# Altium project WaveyRadar.PrjPcb (part 1 of 2)
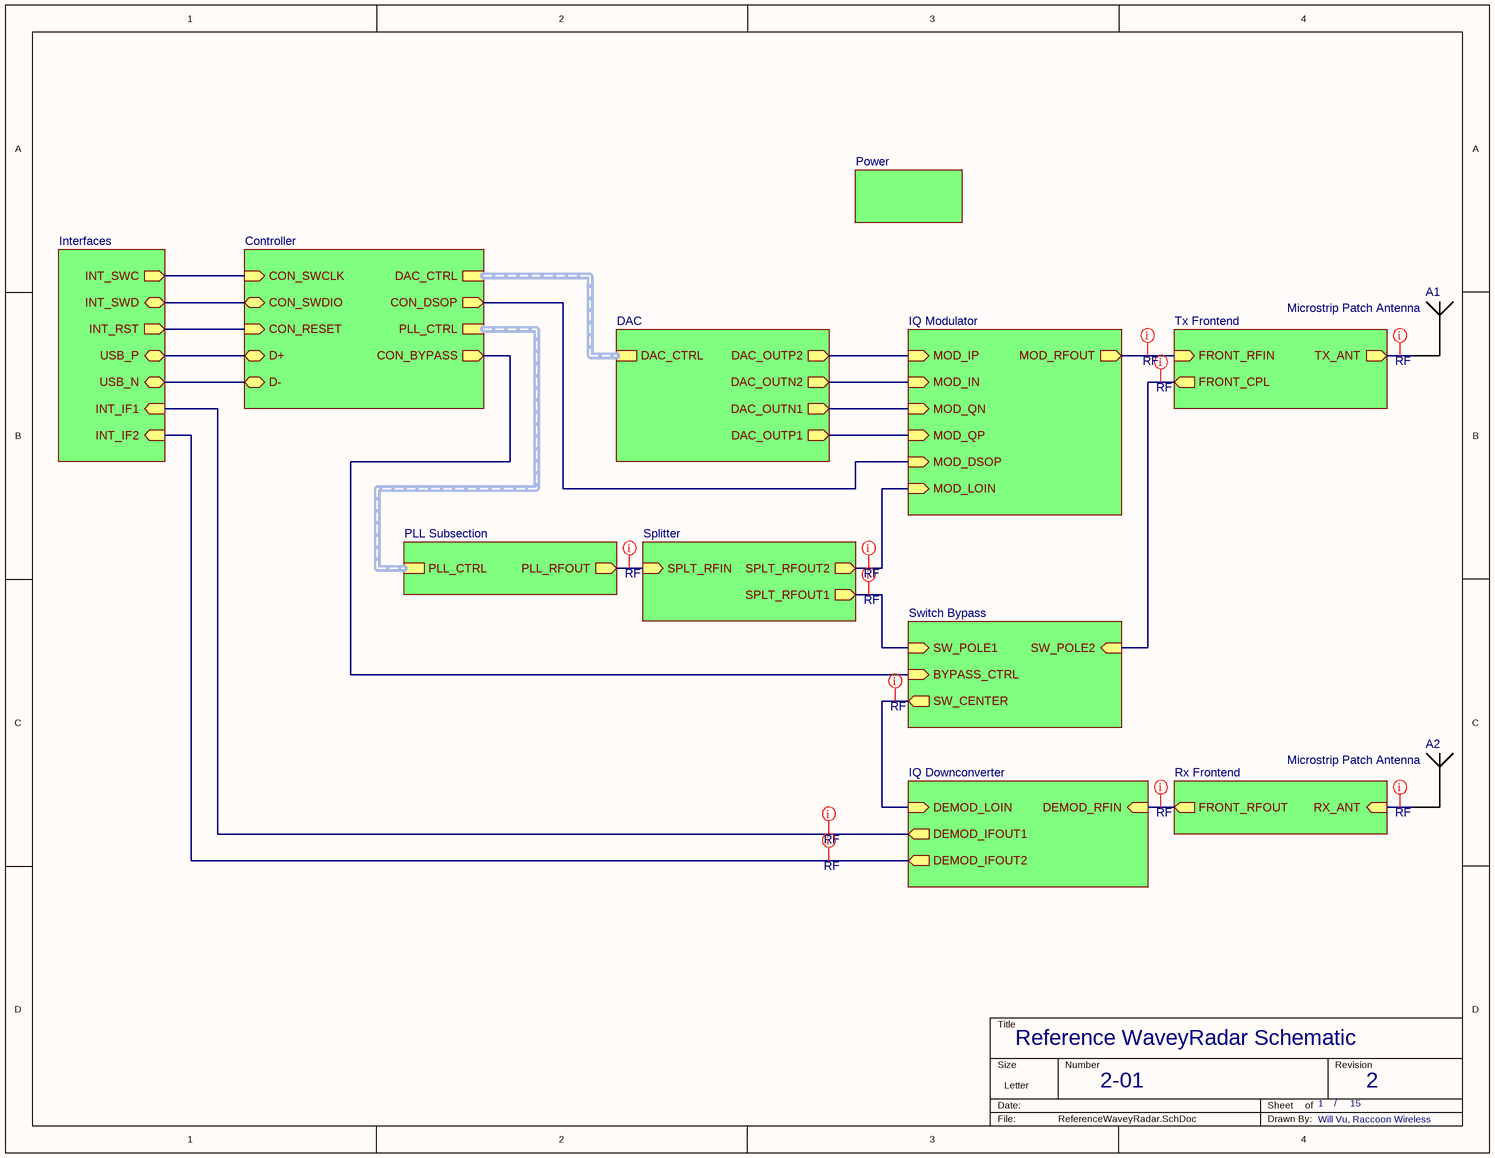
[diagram p0: ReferenceWaveyRadar.SchDoc]
Project Name: WaveyRadar
15 sheets, 143 parts. Net scope: hierarchical (ports join the sheet entries above them; power ports are global).
Board file: PCBWaveyRadar.PcbDoc
Sheets:
  ReferenceWaveyRadar.SchDoc
    Controller = ControllerWaveyRadar.SchDoc
    DAC = DACWaveyRadar.SchDoc
    IQ Downconverter = IQDownconverterWaveyRadar.SchDoc
    IQ Modulator = IQModulatorWaveyRadar.SchDoc
    PLL Subsection = PLLSubsectionWaveyRadar.SchDoc
      Ramp PLL = RampPLLWaveyRadar.SchDoc
      Loop Filter = LoopFilterWaveyRadar.SchDoc
      VCO = VCOWaveyRadar.SchDoc
    Power = PowerWaveyRadar.SchDoc
    Splitter = SplitterWaveyRadar.SchDoc
    Switch Bypass = SwitchBypassWaveyRadar.SchDoc
    Tx Frontend = TxFrontendWaveyRadar.SchDoc
    Rx Frontend = RxFrontendWaveyRadar.SchDoc
    Interfaces = InterfacesWaveyRadar.SchDoc

## Sheet ReferenceWaveyRadar.SchDoc: Reference WaveyRadar Schematic
size Letter; Author: Will Vu; CompanyName: Raccoon Wireless; DrawnBy: Will Vu, Raccoon Wireless; Engineer: Will Vu; Organization: Raccoon Wireless; DocumentNumber: 2-01; Revision: 2; SheetNumber: 1; SheetTotal: 15

### Parts
A1  Microstrip Patch Antenna  [Microstrip Patch Antenna]
A2  Microstrip Patch Antenna  [Microstrip Patch Antenna]

### Sub-sheets
Controller = ControllerWaveyRadar.SchDoc: D+ (bidir), D- (bidir), CON_SWDIO (bidir), CON_SWCLK (in), PLL_CTRL (harness PLL Control), DAC_CTRL (harness DAC Control), CON_BYPASS (out), CON_DSOP (out), CON_RESET (in)
DAC = DACWaveyRadar.SchDoc: DAC_OUTP2 (out), DAC_OUTN2 (out), DAC_OUTN1 (out), DAC_OUTP1 (out), DAC_CTRL (harness DAC Control)
Interfaces = InterfacesWaveyRadar.SchDoc: USB_N (bidir), USB_P (bidir), INT_SWD (bidir), INT_SWC (out), INT_RST (out), INT_IF1 (in), INT_IF2 (in)
IQ Downconverter = IQDownconverterWaveyRadar.SchDoc: DEMOD_RFIN (in), DEMOD_IFOUT1 (out), DEMOD_IFOUT2 (out), DEMOD_LOIN (in)
IQ Modulator = IQModulatorWaveyRadar.SchDoc: MOD_LOIN (in), MOD_RFOUT (out), MOD_IP (in), MOD_IN (in), MOD_QN (in), MOD_QP (in), MOD_DSOP (in)
PLL Subsection = PLLSubsectionWaveyRadar.SchDoc: PLL_CTRL (harness PLL Control), PLL_RFOUT (out)
Power = PowerWaveyRadar.SchDoc: no entries
Rx Frontend = RxFrontendWaveyRadar.SchDoc: FRONT_RFOUT (out), RX_ANT (in)
Splitter = SplitterWaveyRadar.SchDoc: SPLT_RFIN (in), SPLT_RFOUT2 (out), SPLT_RFOUT1 (out)
Switch Bypass = SwitchBypassWaveyRadar.SchDoc: SW_POLE1 (in), SW_CENTER (out), SW_POLE2 (in), BYPASS_CTRL (in)
Tx Frontend = TxFrontendWaveyRadar.SchDoc: FRONT_RFIN (in), FRONT_CPL (out), TX_ANT (out)

### Nets
D_N: sheet Controller/D-, sheet Interfaces/USB_N
D_P: sheet Controller/D+, sheet Interfaces/USB_P
DAC_OUT1_N: sheet DAC/DAC_OUTN1, sheet IQ Modulator/MOD_QN
DAC_OUT1_P: sheet DAC/DAC_OUTP1, sheet IQ Modulator/MOD_QP
DAC_OUT2_N: sheet DAC/DAC_OUTN2, sheet IQ Modulator/MOD_IN
DAC_OUT2_P: sheet DAC/DAC_OUTP2, sheet IQ Modulator/MOD_IP
NetA1_1: A1.1(RFIN) ; sheet Tx Frontend/TX_ANT
NetA2_1: A2.1(RFIN) ; sheet Rx Frontend/RX_ANT
NetC26_1: sheet Controller/CON_BYPASS, sheet Switch Bypass/BYPASS_CTRL
NetC28_1: sheet IQ Modulator/MOD_LOIN, sheet Splitter/SPLT_RFOUT2
NetC31_2: sheet IQ Modulator/MOD_RFOUT, sheet Tx Frontend/FRONT_RFIN
NetDC1_6: sheet Switch Bypass/SW_POLE2, sheet Tx Frontend/FRONT_CPL
NetIC1_3: sheet IQ Downconverter/DEMOD_LOIN, sheet Switch Bypass/SW_CENTER
NetIC1_9: sheet Splitter/SPLT_RFOUT1, sheet Switch Bypass/SW_POLE1
NetJ5_1: sheet IQ Downconverter/DEMOD_IFOUT1, sheet Interfaces/INT_IF1
NetJ6_1: sheet IQ Downconverter/DEMOD_IFOUT2, sheet Interfaces/INT_IF2
NetJ7_1: sheet Controller/CON_SWDIO, sheet Interfaces/INT_SWD
NetJ7_2: sheet Controller/CON_SWCLK, sheet Interfaces/INT_SWC
NetJ7_3: sheet Controller/CON_RESET, sheet Interfaces/INT_RST
NetR12_1: sheet PLL Subsection/PLL_RFOUT, sheet Splitter/SPLT_RFIN
NetU5_1: sheet Controller/CON_DSOP, sheet IQ Modulator/MOD_DSOP
NetU7_5: sheet IQ Downconverter/DEMOD_RFIN, sheet Rx Frontend/FRONT_RFOUT

### Buses and harness runs
harness sheet Controller/DAC_CTRL = sheet DAC/DAC_CTRL
harness sheet Controller/PLL_CTRL = sheet PLL Subsection/PLL_CTRL

### Layout directives
net class RF: NetA1_1, NetA2_1, NetC28_1, NetC31_2, NetDC1_6, NetIC1_3, NetIC1_9, NetJ5_1, NetJ6_1, NetR12_1, NetU7_5

### Notes on the sheet
- /

### Library data of the parts
A1 A2 = CMP-00025-00007-16: PCB Patch Antenna

## Sheet ControllerWaveyRadar.SchDoc: Controller WaveyRadar Schematic
size Letter; Author: Will Vu; CompanyName: Raccoon Wireless; DrawnBy: Will Vu, Raccoon Wireless; Engineer: Will Vu; Organization: Raccoon Wireless; DocumentNumber: 2-15; Revision: 2; SheetNumber: 15; SheetTotal: 15
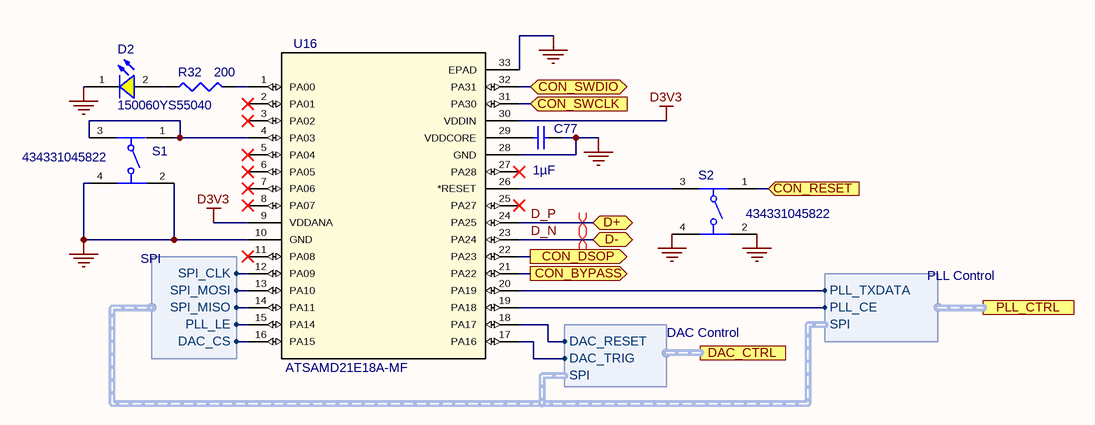
[diagram p1: ControllerWaveyRadar.SchDoc]

### Parts
C77  value 1µF  [CAPC0402(1005)60_L]  (hidden comment: Capacitor 1µF +/-20% 10V 0402)
D2  150060YS55040  [WL-SMCD_0603]
R32  value 200  [RESC0402(1005)_L]  (hidden comment: Resistor 200R +/-5 % 0402 63 mW)
S1  434331045822  [434331045822]
S2  434331045822  [434331045822]
U16  ATSAMD21E18A-MF  [QFN32_5X5MC_MCH]

### Ports
CON_BYPASS (out), CON_DSOP (out), CON_RESET (in), CON_SWCLK (in), CON_SWDIO (bidir), D+ (bidir), D- (bidir), DAC_CTRL (harness DAC Control), PLL_CTRL (harness PLL Control)

### Harnesses
PLL Control: PLL_CE, PLL_TXDATA, SPI
DAC Control: SPI, DAC_RESET, DAC_TRIG
SPI: SPI_MOSI, SPI_CLK, PLL_LE, SPI_MISO, DAC_CS

### Nets
D3V3: U16.9(VDDANA) U16.30(VDDIN)
GND: C77.2 D2.1(K) S1.2 S1.4 S2.2 S2.4 U16.10(GND) U16.28(GND) U16.33(EPAD)
D_N: U16.23(PA24) ; port D-
D_P: U16.24(PA25) ; port D+
NetC26_1: U16.21(PA22) ; port CON_BYPASS
NetC77_1: C77.1 U16.29(VDDCORE)
NetD2_2: D2.2(A) R32.1
NetJ7_1: U16.32(PA31) ; port CON_SWDIO
NetJ7_2: U16.31(PA30) ; port CON_SWCLK
NetJ7_3: S2.1 ; port CON_RESET
NetR32_2: R32.2 U16.1(PA00)
NetS1_1: S1.1 S1.3 U16.4(PA03)
NetS2_3: S2.3 U16.26(*RESET)
NetU2_11: U16.14(PA11) ; harness SPI.SPI_MISO
NetU2_12: U16.15(PA14) ; harness SPI.PLL_LE
NetU2_13: U16.19(PA18) ; port PLL_CTRL.PLL_CE
NetU2_14: U16.20(PA19) ; port PLL_CTRL.PLL_TXDATA
NetU2_15: U16.13(PA10) ; harness SPI.SPI_MOSI
NetU2_16: U16.12(PA09) ; harness SPI.SPI_CLK
NetU5_1: U16.22(PA23) ; port CON_DSOP
NetU6_8: U16.16(PA15) ; harness SPI.DAC_CS
NetU6_9: U16.18(PA17) ; port DAC_CTRL.DAC_RESET
NetU6_32: U16.17(PA16) ; port DAC_CTRL.DAC_TRIG

Not connected (* = marked no-connect by the designer): U16 2(PA01)* 3(PA02)* 5(PA04)* 6(PA05)* 7(PA06)* 8(PA07)* 11(PA08)* 25(PA27)* 27(PA28)*

### Layout directives
differential pair: D_N, D_P

### Notes on the sheet
- /

### Library data of the parts
C77 = CMP-001-00063-4: Chip Capacitor, 1µF +/-20%, 10V, 0402, Thickness 0.6 mm; Tolerance: 10%; Max Operating Temperature: 85°C; Mounting Technology: SMT; Pins: 2; Min Operating Temperature: -55°C; Voltage Rating: 10V; Case/Package: 0402
D2 = CMP-072-000005-2: WL-SMCD SMT Mono-color Chip LED Diffused, size 0603, Yellow, 2V, 140deg; Chip Technology: AlInGaP; Dominant Wavelength: 589nm; Luminous Intensity: 100mcd; Peak Wavelength: 591nm; ComponentLink1Description: Manufacturer; Publisher: Wurth Elektronik; Part Number: 150060YS55040; Design Item ID: 150060YS55040; Viewing Angle: 140deg; ComponentLink1URL: http://www.we-online.de; Emitting Color: Yellow; ComponentLink2URL: https://katalog.we-online.de/led/datasheet/150060YS55040.pdf; Packaging: Tape and Reel; ComponentLink2Description: Datasheet; Source: WL-SMCD.SchLib; Mounting Technology: SMT; Published Date: October 2019; Operating Temperature: -40 to +85degC; Forward Voltage: 2V; Size: 0603
R32 = CMP-009-00161-4: Chip Resistor, 200 Ohms, +/-5 %, 63 mW, -55 to 155 degC, 0402; Power: 63mW; Tolerance: 5%; Pins: 2; Max Operating Temperature: 155°C; Min Operating Temperature: -55°C; Case/Package: 0402
S1 S2 = CMP-083-000001-1: WS-TASU SMT Tact Switch 4.7x3.5mm side push, height 1.65mm, 220gf; Manufacturer: Wurth Elektronik; Rated Voltage: 12VDC; Washable: No; Rated Current: 50mA; Terminal Material: Copper Alloy; ComponentLink1URL: http://www.we-online.de; Operating Temperature: -40 to +85degC; Design Item ID: 434331045822; ComponentLink1Description: Manufacturer; Published Date: January 2021; Terminal Plating: Silver; Height: 1.65mm; Mounting Technology: SMT; ComponentLink2URL: https://www.we-online.com/catalog/datasheet/434331045822.pdf; ComponentLink2Description: Datasheet; Operation Force: 220gf; Contact Plating: Silver; Contact Material: Stainless Steel; Source: WS-TASU.SchLib; Packaging: Tape and Reel; Manufacturer Part Number: 434331045822
U16 = CMP-056-000000-3: No Description Available; Built_By: EMA_Molly; SourceLibrary: Microchip_2019-08-23_25; Vendor: Microchip; Type: DEV; Manufacturer_Part_Number: ATSAMD21E18A-MF; Design Item ID: ATSAMD21E18A-MF; RefDes: RefDes; Source: 2021-06-30_23-48-05.SchLib; Copyright: Copyright (C) 2018 Accelerated Designs. All rights reserved

## Sheet DACWaveyRadar.SchDoc: DAC WaveyRadar Schematic
size Letter; Author: Will Vu; CompanyName: Raccoon Wireless; DrawnBy: Will Vu, Raccoon Wireless; Engineer: Will Vu; Organization: Raccoon Wireless; DocumentNumber: 2-09; Revision: 2; SheetNumber: 9; SheetTotal: 15
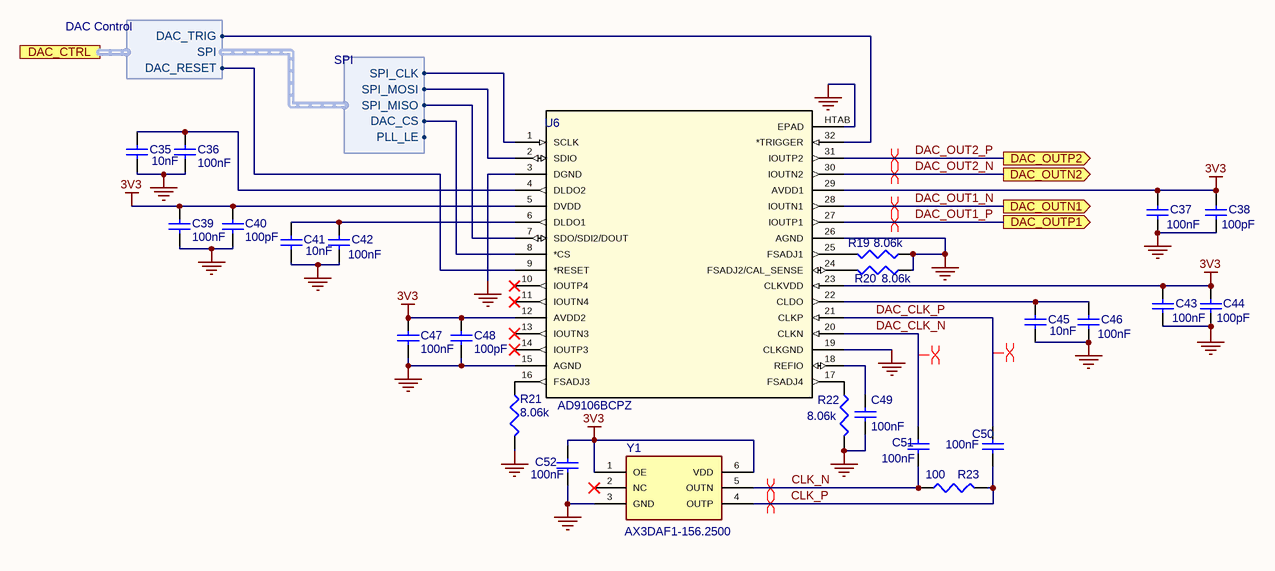
[diagram p2: DACWaveyRadar.SchDoc]

### Parts
C35  value 10nF  [CAPC0402(1005)60_L]  (hidden comment: Capacitor 10nF +/-20% 50V 0402)
C36  value 100nF  [CAPC0402(1005)60_L]  (hidden comment: Capacitor 100nF +/-20% 10V 0402)
C37  value 100nF  [CAPC0402(1005)60_L]  (hidden comment: Capacitor 100nF +/-20% 10V 0402)
C38  value 100pF  [CAPC1005X56X25LL10T15]  (hidden comment: 04023A101JAT2A)
C39  value 100nF  [CAPC0402(1005)60_L]  (hidden comment: Capacitor 100nF +/-20% 10V 0402)
C40  value 100pF  [CAPC1005X56X25LL10T15]  (hidden comment: 04023A101JAT2A)
C41  value 10nF  [CAPC0402(1005)60_L]  (hidden comment: Capacitor 10nF +/-20% 50V 0402)
C42  value 100nF  [CAPC0402(1005)60_L]  (hidden comment: Capacitor 100nF +/-20% 10V 0402)
C43  value 100nF  [CAPC0402(1005)60_L]  (hidden comment: Capacitor 100nF +/-20% 10V 0402)
C44  value 100pF  [CAPC1005X56X25LL10T15]  (hidden comment: 04023A101JAT2A)
C45  value 10nF  [CAPC0402(1005)60_L]  (hidden comment: Capacitor 10nF +/-20% 50V 0402)
C46  value 100nF  [CAPC0402(1005)60_L]  (hidden comment: Capacitor 100nF +/-20% 10V 0402)
C47  value 100nF  [CAPC0402(1005)60_L]  (hidden comment: Capacitor 100nF +/-20% 10V 0402)
C48  value 100pF  [CAPC1005X56X25LL10T15]  (hidden comment: 04023A101JAT2A)
C49  value 100nF  [CAPC0402(1005)60_L]  (hidden comment: Capacitor 100nF +/-20% 10V 0402)
C50  value 100nF  [CAPC0402(1005)60_L]  (hidden comment: Capacitor 100nF +/-20% 10V 0402)
C51  value 100nF  [CAPC0402(1005)60_L]  (hidden comment: Capacitor 100nF +/-20% 10V 0402)
C52  value 100nF  [CAPC0402(1005)60_L]  (hidden comment: Capacitor 100nF +/-20% 10V 0402)
R19  value 8.06k  [RESC1005X40X25ML05T05]  (hidden comment: CRCW04028K06FKED)
R20  value 8.06k  [RESC1005X40X25ML05T05]  (hidden comment: CRCW04028K06FKED)
R21  value 8.06k  [RESC1005X40X25ML05T05]  (hidden comment: CRCW04028K06FKED)
R22  value 8.06k  [RESC1005X40X25ML05T05]  (hidden comment: CRCW04028K06FKED)
R23  value 100  [RESC0402(1005)_L]  (hidden comment: Resistor 100R +/-1 % 0402 63 mW)
U6  AD9106BCPZ  [CP_32_12_ADI]
Y1  AX3DAF1-156.2500  [AX3DAF1]

### Ports
DAC_CTRL (harness DAC Control), DAC_OUTN1 (out), DAC_OUTN2 (out), DAC_OUTP1 (out), DAC_OUTP2 (out)

### Harnesses
SPI: SPI_MOSI, SPI_CLK, PLL_LE, SPI_MISO, DAC_CS
DAC Control: SPI, DAC_RESET, DAC_TRIG

### Nets
3V3: C37.2 C38.2 C39.1 C40.1 C43.2 C44.2 C47.1 C48.1 C52.1 U6.5(DVDD) U6.12(AVDD2) U6.23(CLKVDD) U6.29(AVDD1) Y1.1(OE) Y1.6(VDD)
GND: C35.2 C36.1 C37.1 C38.1 C39.2 C40.2 C41.2 C42.1 C43.1 C44.1 C45.2 C46.1 C47.2 C48.2 C49.2 C52.2 R19.1 R20.1 R21.2 R22.2 U6.3(DGND) U6.15(AGND) U6.19(CLKGND) U6.26(AGND) U6.HTAB(EPAD) Y1.3(GND)
CLK_N: C51.2 R23.1 Y1.5(OUTN)
CLK_P: C50.2 R23.2 Y1.4(OUTP)
DAC_CLK_N: C51.1 U6.20(CLKN)
DAC_CLK_P: C50.1 U6.21(CLKP)
DAC_OUT1_N: U6.28(IOUTN1) ; port DAC_OUTN1
DAC_OUT1_P: U6.27(IOUTP1) ; port DAC_OUTP1
DAC_OUT2_N: U6.30(IOUTN2) ; port DAC_OUTN2
DAC_OUT2_P: U6.31(IOUTP2) ; port DAC_OUTP2
NetC35_1: C35.1 C36.2 U6.4(DLDO2)
NetC41_1: C41.1 C42.2 U6.6(DLDO1)
NetC45_1: C45.1 C46.2 U6.22(CLDO)
NetC49_1: C49.1 U6.18(REFIO)
NetR19_2: R19.2 U6.25(FSADJ1)
NetR20_2: R20.2 U6.24(FSADJ2/CAL_SENSE)
NetR21_1: R21.1 U6.16(FSADJ3)
NetR22_1: R22.1 U6.17(FSADJ4)
NetU2_11: U6.7(SDO/SDI2/DOUT) ; harness SPI.SPI_MISO
NetU2_15: U6.2(SDIO) ; harness SPI.SPI_MOSI
NetU2_16: U6.1(SCLK) ; harness SPI.SPI_CLK
NetU6_8: U6.8(*CS) ; harness SPI.DAC_CS
NetU6_9: U6.9(*RESET) ; port DAC_CTRL.DAC_RESET
NetU6_32: U6.32(*TRIGGER) ; port DAC_CTRL.DAC_TRIG

Not connected (* = marked no-connect by the designer): U6 10(IOUTP4)* 11(IOUTN4)* 13(IOUTN3)* 14(IOUTP3)*; Y1 2(NC)*

### Layout directives
differential pair: CLK_N, CLK_P, DAC_CLK_N, DAC_CLK_P, DAC_OUT1_N, DAC_OUT1_P, DAC_OUT2_N, DAC_OUT2_P

### Notes on the sheet
- /

### Library data of the parts
C35 C41 C45 = CMP-001-00069-4: Chip Capacitor, 10nF +/-20%, 50V, 0402, Thickness 0.6 mm; Tolerance: 5%; Max Operating Temperature: 85°C; Voltage Rating: 50V; Case/Package: 0402; Pins: 2; Min Operating Temperature: -55°C; Mounting Technology: SMT
C36 C37 C39 C42 C43 C46 C47 C49-C52 = CMP-001-00061-4: Chip Capacitor, 100nF +/-20%, 10V, 0402, Thickness 0.6 mm; Tolerance: 20%; Case/Package: 0402; Voltage Rating: 10V; Pins: 2; Mounting Technology: SMT; Max Operating Temperature: 85°C; Min Operating Temperature: -55°C
C38 C40 C44 C48 = CMP-001-00083-2: AVX - 04023A101JAT2A - SMD Multilayer Ceramic Capacitor, 100 pF, 25 V, 0402 [1005 Metric], ± 5%, C0G / NP0, AVX 0402 MLCC
R19-R22 = CMP-009-00189-1: Res Thick Film 0402 8.06K Ohm 1% 0.063W(1/16W) ±100ppm/C Molded SMD Automotive Paper T/R
R23 = CMP-009-00167-4: Chip Resistor, 100 Ohms, +/-1 %, 63 mW, -55 to 155 degC, 0402; Power: 63mW; Tolerance: 1%; Pins: 2; Min Operating Temperature: -55°C; Case/Package: 0402; Max Operating Temperature: 155°C
U6 = CMP-014-000000-5: No Description Available; Vendor: Analog Devices Inc; SourceLibrary: Analog_2015-01-06; Built_By: EMA_UL_Team; Design Item ID: AD9106BCPZ; Type: DEV; Copyright: Copyright (C) 2018 Accelerated Designs. All rights reserved; RefDes: RefDes; Source: 2021-05-30_21-42-50.SchLib; Manufacturer_Part_Number: AD9106BCPZ
Y1 = CMP-017-000000-3: Oscillator XO 156.25MHz ±50ppm LVDS 55% 3.3V 6-Pin SMD Bulk; Manufacturer_Name: ABRACON; Height: 1.1mm; Datasheet Link: https://abracon.com/datasheets/AX3.pdf; Source: SamacSys.SchLib; Manufacturer_Part_Number: AX3DAF1-156.2500; Value: 156.25MHz; Design Item ID: AX3DAF1-156.2500

## Sheet IQDownconverterWaveyRadar.SchDoc: IQ Downconverter WaveyRadar Schematic
size Letter; Author: Will Vu; CompanyName: Raccoon Wireless; DrawnBy: Will Vu, Raccoon Wireless; Engineer: Will Vu; Organization: Raccoon Wireless; DocumentNumber: 2-10; Revision: 2; SheetNumber: 10; SheetTotal: 15
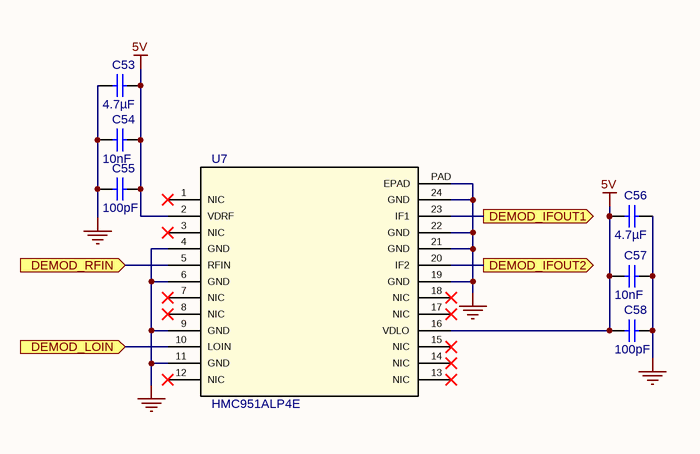
[diagram p3: IQDownconverterWaveyRadar.SchDoc]

### Parts
C53  value 4.7µF  [CAPC0603(1608)100_L]  (hidden comment: Capacitor 4.7µF +/-20% 10V 0603)
C54  value 10nF  [CAPC0402(1005)60_L]  (hidden comment: Capacitor 10nF +/-20% 50V 0402)
C55  value 100pF  [CAPC1005X56X25LL10T15]  (hidden comment: 04023A101JAT2A)
C56  value 4.7µF  [CAPC0603(1608)100_L]  (hidden comment: Capacitor 4.7µF +/-20% 10V 0603)
C57  value 10nF  [CAPC0402(1005)60_L]  (hidden comment: Capacitor 10nF +/-20% 50V 0402)
C58  value 100pF  [CAPC1005X56X25LL10T15]  (hidden comment: 04023A101JAT2A)
U7  HMC951ALP4E  [HCP_24_3]

### Ports
DEMOD_IFOUT1 (out), DEMOD_IFOUT2 (out), DEMOD_LOIN (in), DEMOD_RFIN (in)

### Nets
5V: C53.2 C54.2 C55.2 C56.1 C57.1 C58.1 U7.2(VDRF) U7.16(VDLO)
GND: C53.1 C54.1 C55.1 C56.2 C57.2 C58.2 U7.4(GND) U7.6(GND) U7.9(GND) U7.11(GND) U7.19(GND) U7.21(GND) U7.22(GND) U7.24(GND) U7.PAD(EPAD)
NetIC1_3: U7.10(LOIN) ; port DEMOD_LOIN
NetJ5_1: U7.23(IF1) ; port DEMOD_IFOUT1
NetJ6_1: U7.20(IF2) ; port DEMOD_IFOUT2
NetU7_5: U7.5(RFIN) ; port DEMOD_RFIN

Not connected (* = marked no-connect by the designer): U7 1(NIC)* 3(NIC)* 7(NIC)* 8(NIC)* 12(NIC)* 13(NIC)* 14(NIC)* 15(NIC)* 17(NIC)* 18(NIC)*

### Notes on the sheet
- /

### Library data of the parts
C53 C56 = CMP-001-00076-5: Chip Capacitor, 4.7µF +/-20%, 10V, 0603, Thickness 1 mm; Tolerance: 10%; Mounting Technology: SMT; Pins: 2; Max Operating Temperature: 85°C; Case/Package: 0603; Voltage Rating: 10V; Min Operating Temperature: -55°C
C54 C57 = CMP-001-00069-4: as C35 on sheet DACWaveyRadar; Max Operating Temperature: 85°C; Voltage Rating: 50V; Case/Package: 0402; Pins: 2; Min Operating Temperature: -55°C; Mounting Technology: SMT
C55 C58 = CMP-001-00083-2: as C38 on sheet DACWaveyRadar
U7 = CMP-021-000000-5: 5.6  GHz to 8.6 GHz, GaAs, MMIC, I/Q Downconverter; RefDes: RefDes; Copyright: Copyright (C) 2018 Accelerated Designs. All rights reserved; Type: DEV; Design Item ID: HMC951ALP4E; Source: 2021-05-31_20-45-29.SchLib

## Sheet IQModulatorWaveyRadar.SchDoc: IQ Modulator WaveyRadar Schematic
size Letter; Author: Will Vu; CompanyName: Raccoon Wireless; DrawnBy: Will Vu, Raccoon Wireless; Engineer: Will Vu; Organization: Raccoon Wireless; DocumentNumber: 2-08; Revision: 2; SheetNumber: 8; SheetTotal: 15
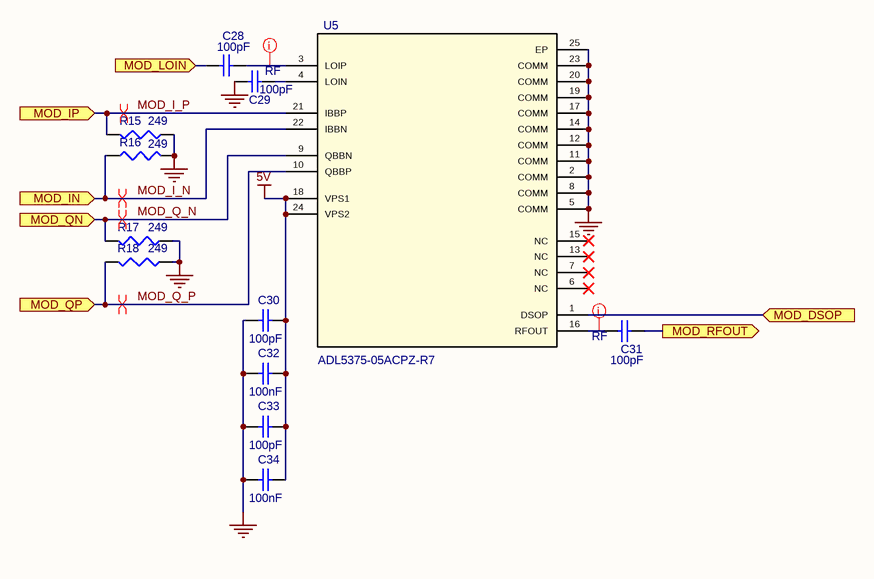
[diagram p4: IQModulatorWaveyRadar.SchDoc]

### Parts
C28  value 100pF  [CAPC1005X56X25LL10T15]  (hidden comment: 04023A101JAT2A)
C29  value 100pF  [CAPC1005X56X25LL10T15]  (hidden comment: 04023A101JAT2A)
C30  value 100pF  [CAPC1005X56X25LL10T15]  (hidden comment: 04023A101JAT2A)
C31  value 100pF  [CAPC1005X56X25LL10T15]  (hidden comment: 04023A101JAT2A)
C32  value 100nF  [CAPC0402(1005)60_L]  (hidden comment: Capacitor 100nF +/-20% 10V 0402)
C33  value 100pF  [CAPC1005X56X25LL10T15]  (hidden comment: 04023A101JAT2A)
C34  value 100nF  [CAPC0402(1005)60_L]  (hidden comment: Capacitor 100nF +/-20% 10V 0402)
R15  value 249  [RESC1005X40X25NL05T05]  (hidden comment: ERJ-2RKF2490X)
R16  value 249  [RESC1005X40X25NL05T05]  (hidden comment: ERJ-2RKF2490X)
R17  value 249  [RESC1005X40X25NL05T05]  (hidden comment: ERJ-2RKF2490X)
R18  value 249  [RESC1005X40X25NL05T05]  (hidden comment: ERJ-2RKF2490X)
U5  ADL5375-05ACPZ-R7  [CP_24_7_ADI]

### Ports
MOD_DSOP (in), MOD_IN (in), MOD_IP (in), MOD_LOIN (in), MOD_QN (in), MOD_QP (in), MOD_RFOUT (out)

### Nets
5V: C30.2 C32.2 C33.2 C34.2 U5.18(VPS1) U5.24(VPS2)
GND: C29.1 C30.1 C32.1 C33.1 C34.1 R15.1 R16.2 R17.1 R18.1 U5.2(COMM) U5.5(COMM) U5.8(COMM) U5.11(COMM) U5.12(COMM) U5.14(COMM) U5.17(COMM) U5.19(COMM) U5.20(COMM) U5.23(COMM) U5.25(EP)
MOD_I_N: R16.1 U5.22(IBBN) ; port MOD_IN  [project net DAC_OUT2_N]
MOD_I_P: R15.2 U5.21(IBBP) ; port MOD_IP  [project net DAC_OUT2_P]
MOD_Q_N: R17.2 U5.9(QBBN) ; port MOD_QN  [project net DAC_OUT1_N]
MOD_Q_P: R18.2 U5.10(QBBP) ; port MOD_QP  [project net DAC_OUT1_P]
NetC28_1: C28.1 ; port MOD_LOIN
NetC28_2: C28.2 U5.3(LOIP)
NetC29_2: C29.2 U5.4(LOIN)
NetC31_1: C31.1 U5.16(RFOUT)
NetC31_2: C31.2 ; port MOD_RFOUT
NetU5_1: U5.1(DSOP) ; port MOD_DSOP

Not connected (* = marked no-connect by the designer): U5 6(NC)* 7(NC)* 13(NC)* 15(NC)*

### Layout directives
differential pair: DAC_OUT1_N, DAC_OUT1_P, DAC_OUT2_N, DAC_OUT2_P
net class RF: NetC28_2, NetC31_1

### Notes on the sheet
- /

### Library data of the parts
C28-C31 C33 = CMP-001-00083-2: as C38 on sheet DACWaveyRadar
C32 C34 = CMP-001-00061-4: as C36 on sheet DACWaveyRadar; Case/Package: 0402; Voltage Rating: 10V; Pins: 2; Mounting Technology: SMT; Max Operating Temperature: 85°C; Min Operating Temperature: -55°C
R15-R18 = CMP-009-00185-1: RESISTOR, 0402, 249R 1%, 0.1W
U5 = CMP-007-000001-5: IC MOD QUAD 400MHZ-6GHZ 24LFCSP; P1dB: 10.4dBm; Built_By: EMA_UL_Team; Output Power (dBm): 1.71dBm; Operating Supply Voltage: 5.25V; Supply Current: 174mA; Max Power Dissipation: 1.5W; Operating Supply Current: 200mA; SourceLibrary: Analog_2015-12-15; Vendor: Analog Devices Inc; Test Frequency: 3.5GHz; Source: 2021-05-25_00-39-48.SchLib; Case/Package: LFCSP EP; Type: DEV; Min Operating Temperature: -40°C; RoHS Compliant: Yes; Copyright: Copyright (C) 2018 Accelerated Designs. All rights reserved; Packaging: Tape and Reel; RefDes: RefDes; Radiation Hardening: No; Max Operating Temperature: 85°C; Design Item ID: ADL5375-05ACPZ-R7; Package Quantity: 1; Number of Pins: 24; Lead Free: Contains Lead; Nominal Supply Current: 174mA; Series: -; Manufacturer_Part_Number: ADL5375-05ACPZ-R7

## Sheet PLLSubsectionWaveyRadar.SchDoc: PLL Subsection WaveyRadar Schematic
size Letter; Author: Will Vu; CompanyName: Raccoon Wireless; DrawnBy: Will Vu, Raccoon Wireless; Engineer: Will Vu; Organization: Raccoon Wireless; DocumentNumber: 2-02; Revision: 2; SheetNumber: 2; SheetTotal: 15
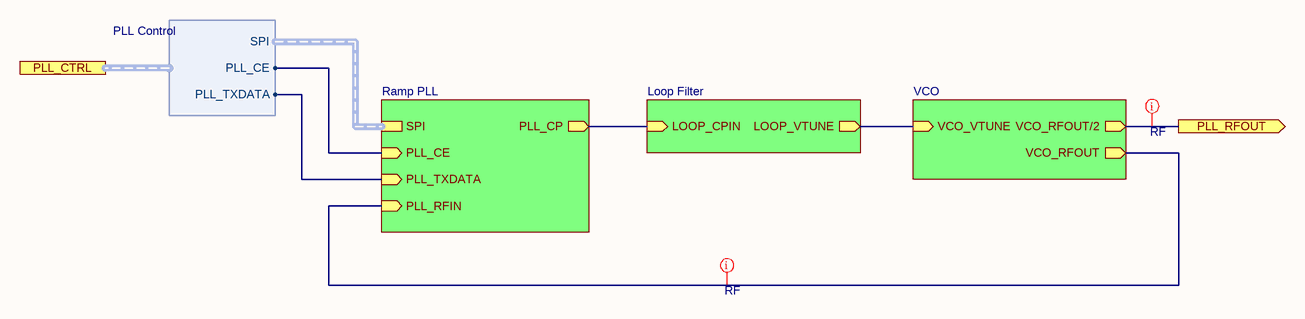
[diagram p5: PLLSubsectionWaveyRadar.SchDoc]

### Sub-sheets
Loop Filter = LoopFilterWaveyRadar.SchDoc: LOOP_VTUNE (out), LOOP_CPIN (in)
Ramp PLL = RampPLLWaveyRadar.SchDoc: SPI (harness SPI), PLL_RFIN (in), PLL_TXDATA (in), PLL_CE (in), PLL_CP (out)
VCO = VCOWaveyRadar.SchDoc: VCO_RFOUT/2 (out), VCO_RFOUT (out), VCO_VTUNE (in)

### Ports
PLL_CTRL (harness PLL Control), PLL_RFOUT (out)

### Harnesses
PLL Control: PLL_CE, PLL_TXDATA, SPI

### Nets
NetC15_2: sheet Ramp PLL/PLL_CP, sheet Loop Filter/LOOP_CPIN
NetC16_1: sheet Loop Filter/LOOP_VTUNE, sheet VCO/VCO_VTUNE
NetR1_1: sheet Ramp PLL/PLL_RFIN, sheet VCO/VCO_RFOUT
NetR12_1: port PLL_RFOUT, sheet VCO/VCO_RFOUT/2
NetU2_13: sheet Ramp PLL/PLL_CE, port PLL_CTRL.PLL_CE
NetU2_14: sheet Ramp PLL/PLL_TXDATA, port PLL_CTRL.PLL_TXDATA

### Layout directives
net class RF: NetR1_1, NetR12_1

### Notes on the sheet
- /

## Sheet RampPLLWaveyRadar.SchDoc: Ramp PLL WaveyRadar Schematic
size Letter; Author: Will Vu; CompanyName: Raccoon Wireless; DrawnBy: Will Vu, Raccoon Wireless; Engineer: Will Vu; Organization: Raccoon Wireless; DocumentNumber: 2-03; Revision: 2; SheetNumber: 3; SheetTotal: 15
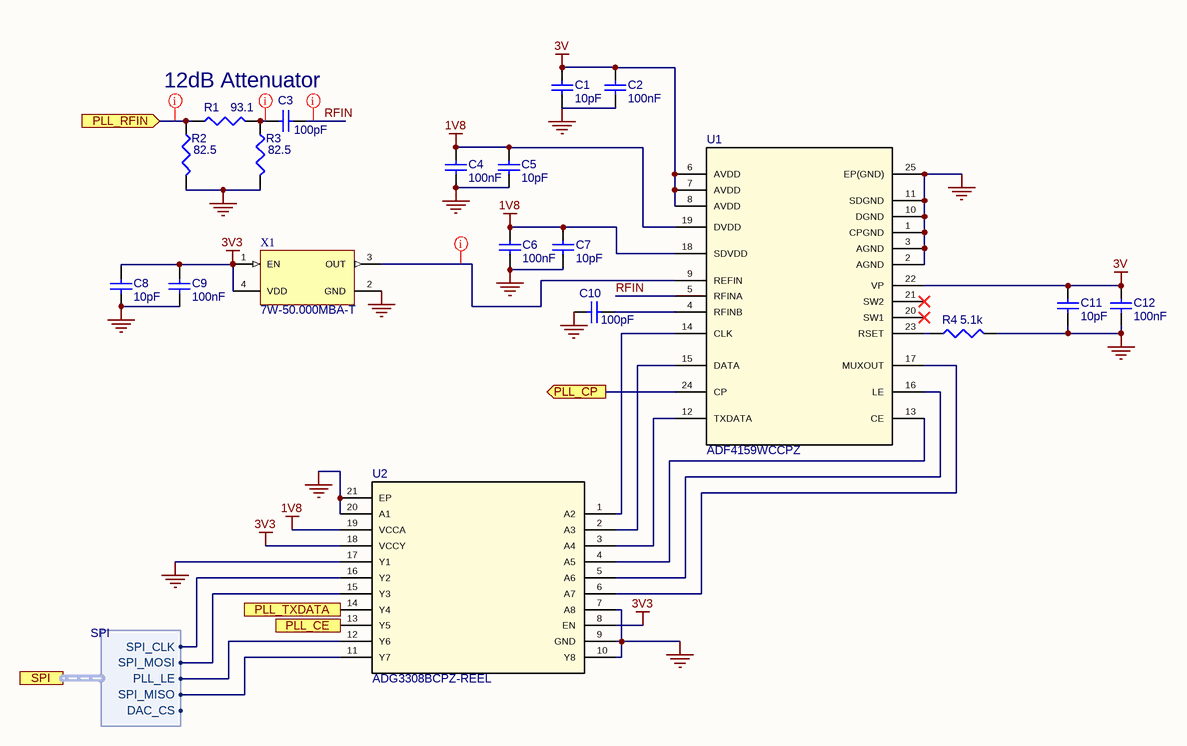
[diagram p6: RampPLLWaveyRadar.SchDoc]

### Parts
C1  value 10pF  [CAPC1005X55X30LL05T10]  (hidden comment: Capacitor 10 pF +/- 0.25 pF 50 V 0402)
C2  value 100nF  [CAPC0402(1005)60_L]  (hidden comment: Capacitor 100nF +/-20% 10V 0402)
C3  value 100pF  [CAPC1005X56X25LL10T15]  (hidden comment: 04023A101JAT2A)
C4  value 100nF  [CAPC0402(1005)60_L]  (hidden comment: Capacitor 100nF +/-20% 10V 0402)
C5  value 10pF  [CAPC1005X55X30LL05T10]  (hidden comment: Capacitor 10 pF +/- 0.25 pF 50 V 0402)
C6  value 100nF  [CAPC0402(1005)60_L]  (hidden comment: Capacitor 100nF +/-20% 10V 0402)
C7  value 10pF  [CAPC1005X55X30LL05T10]  (hidden comment: Capacitor 10 pF +/- 0.25 pF 50 V 0402)
C8  value 10pF  [CAPC1005X55X30LL05T10]  (hidden comment: Capacitor 10 pF +/- 0.25 pF 50 V 0402)
C9  value 100nF  [CAPC0402(1005)60_L]  (hidden comment: Capacitor 100nF +/-20% 10V 0402)
C10  value 100pF  [CAPC1005X56X25LL10T15]  (hidden comment: 04023A101JAT2A)
C11  value 10pF  [CAPC1005X55X30LL05T10]  (hidden comment: Capacitor 10 pF +/- 0.25 pF 50 V 0402)
C12  value 100nF  [CAPC0402(1005)60_L]  (hidden comment: Capacitor 100nF +/-20% 10V 0402)
R1  value 93.1  [RESC1005X40X25LL10T10]  (hidden comment: CR0402-FX-93R1GLF)
R2  value 82.5  [RESC1005X40X25NL05T05]  (hidden comment: ERJ-2RKF82R5X)
R3  value 82.5  [RESC1005X40X25NL05T05]  (hidden comment: ERJ-2RKF82R5X)
R4  value 5.1k  [RESC1005X40X25NL05T05]  (hidden comment: ERJ-2RKF5101X)
U1  ADF4159WCCPZ  [CP_24_10]
U2  ADG3308BCPZ-REEL  [CP_20_1_ADI]
X1  7W-50.000MBA-T  [TXC-L500W700H130-4_V]

### Ports
PLL_CE (in), PLL_CP (out), PLL_RFIN (in), PLL_TXDATA (in), SPI (harness SPI)

### Harnesses
SPI: SPI_MOSI, SPI_CLK, PLL_LE, SPI_MISO, DAC_CS

### Nets
1V8: C4.2 C5.2 C6.2 C7.2 U1.18(SDVDD) U1.19(DVDD) U2.19(VCCA)
3V: C1.2 C2.2 C11.2 C12.2 U1.6(AVDD) U1.7(AVDD) U1.8(AVDD) U1.22(VP)
3V3: C8.2 C9.2 U2.8(EN) U2.18(VCCY) X1.1(EN) X1.4(VDD)
GND: C1.1 C2.1 C4.1 C5.1 C6.1 C7.1 C8.1 C9.1 C10.1 C11.1 C12.1 R2.2 R3.2 R4.2 U1.1(CPGND) U1.2(AGND) U1.3(AGND) U1.10(DGND) U1.11(SDGND) U1.25(EP(GND)) U2.7(A8) U2.9(GND) U2.10(Y8) U2.17(Y1) U2.20(A1) U2.21(EP) X1.2(GND)
RFIN: C3.2 U1.5(RFINA)
NetC3_1: C3.1 R1.2 R3.1
NetC10_2: C10.2 U1.4(RFINB)
NetC15_2: U1.24(CP) ; port PLL_CP
NetR1_1: R1.1 R2.1 ; port PLL_RFIN
NetR4_1: R4.1 U1.23(RSET)
NetU1_9: U1.9(REFIN) X1.3(OUT)
NetU1_12: U1.12(TXDATA) U2.3(A4)
NetU1_13: U1.13(CE) U2.4(A5)
NetU1_14: U1.14(CLK) U2.1(A2)
NetU1_15: U1.15(DATA) U2.2(A3)
NetU1_16: U1.16(LE) U2.5(A6)
NetU1_17: U1.17(MUXOUT) U2.6(A7)
NetU2_11: U2.11(Y7) ; port SPI.SPI_MISO
NetU2_12: U2.12(Y6) ; port SPI.PLL_LE
NetU2_13: U2.13(Y5) ; port PLL_CE
NetU2_14: U2.14(Y4) ; port PLL_TXDATA
NetU2_15: U2.15(Y3) ; port SPI.SPI_MOSI
NetU2_16: U2.16(Y2) ; port SPI.SPI_CLK

Not connected (* = marked no-connect by the designer): U1 20(SW1)* 21(SW2)*

### Layout directives
net class RF: NetC3_1, NetR1_1, NetU1_9, RFIN

### Notes on the sheet
- 12dB Attenuator
- /

### Library data of the parts
C1 C5 C7 C8 C11 = CMP-001-00011-7: Chip Capacitor, 10 pF, +/- 0.25 pF, 50 V, 0402 (1005 Metric); Voltage Rating: 50V; Tolerance: 0.25%; Capacitor Type: Ceramic; Mounting Technology: SM; Pins: 2; Case/Package: 0402; Min Operating Temperature: -55°C; RoHS Compliant: True; Max Operating Temperature: 125°C
C2 C4 C6 C9 C12 = CMP-001-00061-4: as C36 on sheet DACWaveyRadar; Mounting Technology: SMT; Voltage Rating: 10V; Max Operating Temperature: 85°C; Pins: 2; Case/Package: 0402; Min Operating Temperature: -55°C
C3 C10 = CMP-001-00083-2: as C38 on sheet DACWaveyRadar
R1 = CMP-009-00196-1: Thick Film Resistors 93.1OHM 1/16WATT 1%
R2 R3 = CMP-009-00195-1: PANASONIC ELECTRONIC COMPONENTS         ERJ2RKF82R5X             SMD Chip Resistor, Thick Film, 82.5 ohm, 50 V, 0402 [1005 Metric], 100 mW,  1%, ERJ2R Series
R4 = CMP-009-00180-5: PANASONIC - ERJ2RKF5101X - SMD Chip Resistor, 0402 [1005 Metric], 5.1 kohm, ERJ2R Series, 50 V, Thick Film, 100 mW, 5.1k ohm
U1 = ADF4159WCCPZ: No Description Available
U2 = CMP-061-000000-1: No Description Available; Vendor: Analog Devices Inc; Built_By: EMA_UL_Team; SourceLibrary: Analog_2012-01-01_7; Copyright: Copyright (C) 2021 Accelerated Designs. All rights reserved; RefDes: RefDes; Type: DEV; Manufacturer_Part_Number: ADG3308BCPZ-REEL; Design Item ID: ADG3308BCPZ-REEL; Source: 2021-07-05_15-07-55.SchLib
X1 = CMP-003-00030-2: OSCILLATOR, 50 MHz, FULL REEL; Product Range:7W Series; Frequency Nom:50MHz; Frequency Stability + / -:25ppm; Supply Voltage Nom:3.3V; Oscillator Case:SMD, 7mm x 5mm; Oscillator Output Compatibility:CMOS; Frequency:50MHz ;RoHS Compliant: Yes; Value: 50MHz

## Sheet LoopFilterWaveyRadar.SchDoc: Loop Filter WaveyRadar Schematic
size Letter; Author: Will Vu; CompanyName: Raccoon Wireless; DrawnBy: Will Vu, Raccoon Wireless; Engineer: Will Vu; Organization: Raccoon Wireless; DocumentNumber: 2-04; Revision: 2; SheetNumber: 4; SheetTotal: 15
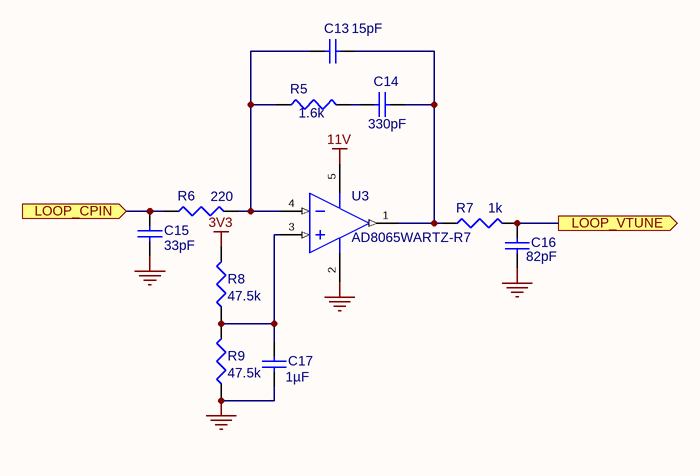
[diagram p7: LoopFilterWaveyRadar.SchDoc]

### Parts
C13  value 15pF  [CAPC1005X56X25LL10T15]  (hidden comment: 04025A150JAT2A)
C14  value 330pF  [FP-GRM155-0_05-MFG]  (hidden comment: GRM1555C1H331JA01D)
C15  value 33pF  [CAPC1005X56X25LL10T15]  (hidden comment: 04025A330JAT2A)
C16  value 82pF  [CAPC1005X56X25LL10T15]  (hidden comment: 04025A820FAT2A)
C17  value 1µF  [CAPC0402(1005)60_L]  (hidden comment: Capacitor 1µF +/-20% 10V 0402)
R5  value 1.6k  [RESC0402(1005)_L]  (hidden comment: Resistor 1K6 +/-5 % 0402 63 mW)
R6  value 220  [RESC1005X40X25NL05T05]  (hidden comment: ERJ-2RKF2200X)
R7  value 1k  [RESC1005X40X25ML05T05]  (hidden comment: Resistor 1k +/-1% 0402 100 mW)
R8  value 47.5k  [RESC0402(1005)_L]  (hidden comment: Resistor 47K5 +/-1 % 0402 63 mW)
R9  value 47.5k  [RESC0402(1005)_L]  (hidden comment: Resistor 47K5 +/-1 % 0402 63 mW)
U3  AD8065WARTZ-R7  [ADI-RJ-5_N]

### Ports
LOOP_CPIN (in), LOOP_VTUNE (out)

### Nets
3V3: R8.2
11V: U3.5(+VS)
GND: C15.1 C16.2 C17.2 R9.1 U3.2(-VS)
NetC13_1: C13.1 R5.1 R6.2 U3.4(-IN)
NetC13_2: C13.2 C14.2 R7.1 U3.1(VOUT)
NetC14_1: C14.1 R5.2
NetC15_2: C15.2 R6.1 ; port LOOP_CPIN
NetC16_1: C16.1 R7.2 ; port LOOP_VTUNE
NetC17_1: C17.1 R8.1 R9.2 U3.3(+IN)

### Notes on the sheet
- /

### Library data of the parts
C13 = CMP-001-00087-1: Cap Ceramic 15pF 50V C0G 5% SMD 0402 125C T/R
C14 = CMP-001-00086-1: MURATA - GRM1555C1H331JA01D - CERAMIC CAPACITOR 330PF 50V, C0G, 5%, 0402
C15 = CMP-001-00084-1: AVX - 04025A330JAT2A - Ceramiczny kondensator wielowarstw. SMD, 33 pF, 50 V, 0402 [jedn. metryczne: 1005], ± 5%, C0G / NP0
C16 = CMP-001-00088-1: Multilayer Ceramic Capacitors MLCC - SMD/SMT 50V 82pF C0G 0402 1% Tol
C17 = CMP-001-00063-4: as C77 on sheet ControllerWaveyRadar; Max Operating Temperature: 85°C; Mounting Technology: SMT; Pins: 2; Min Operating Temperature: -55°C; Voltage Rating: 10V; Case/Package: 0402
R5 = CMP-009-00160-4: Chip Resistor, 1,6 kOhms, +/-5 %, 63 mW, -55 to 155 degC, 0402; Power: 63mW; Tolerance: 5%; Pins: 2; Min Operating Temperature: -55°C; Max Operating Temperature: 155°C; Case/Package: 0402
R6 = CMP-009-00184-1: PANASONIC ELECTRONIC COMPONENTS - ERJ2RKF2200X - RES, THICK FILM, 220R, 1%, 0.1W, 0402
R7 = CMP-009-00009-8: Chip Resistor, 1 KOhm, +/- 1%, 0.1 W, -55 to 155 degC, 0402 (1005 Metric); Voltage Rating: 50V; Power: 100mW; Mounting Technology: SM; Case/Package: 0402; Max Operating Temperature: 155°C; RoHS Compliant: True; Min Operating Temperature: -55°C; Tolerance: 1%; Pins: 2
R8 R9 = CMP-009-00137-4: Chip Resistor, 47,5 kOhms, +/-1 %, 63 mW, -55 to 155 degC, 0402; Tolerance: 1%; Power: 63mW; Min Operating Temperature: -55°C; Case/Package: 0402; Max Operating Temperature: 155°C; Pins: 2
U3 = CMP-014-00002-3: Op Amp Single High Performance Amplifier R-R O/P ±5V/10V Automotive 5-Pin SOT-23 T/R

## Sheet VCOWaveyRadar.SchDoc: VCO WaveyRadar Schematic
size Letter; Author: Will Vu; CompanyName: Raccoon Wireless; DrawnBy: Will Vu, Raccoon Wireless; Engineer: Will Vu; Organization: Raccoon Wireless; DocumentNumber: 2-05; Revision: 2; SheetNumber: 5; SheetTotal: 15
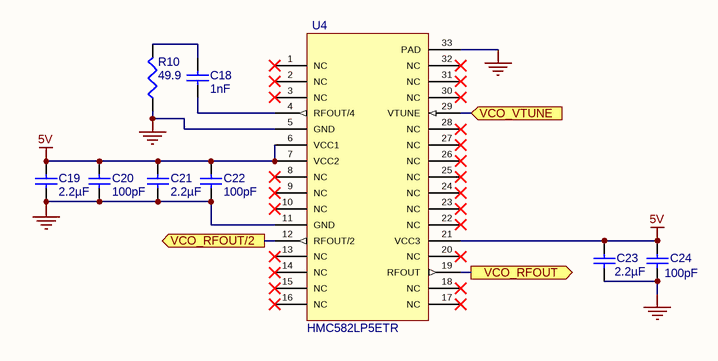
[diagram p8: VCOWaveyRadar.SchDoc]

### Parts
C18  value 1nF  [CAPC0402(1005)33_L]  (hidden comment: Capacitor 1nF +/-20% 50V 0402)
C19  value 2.2µF  [CAPC0402(1005)60_L]  (hidden comment: Capacitor 2,2µF +/-20% 10V 0402)
C20  value 100pF  [CAPC1005X56X25LL10T15]  (hidden comment: 04023A101JAT2A)
C21  value 2.2µF  [CAPC0402(1005)60_L]  (hidden comment: Capacitor 2,2µF +/-20% 10V 0402)
C22  value 100pF  [CAPC1005X56X25LL10T15]  (hidden comment: 04023A101JAT2A)
C23  value 2.2µF  [CAPC0402(1005)60_L]  (hidden comment: Capacitor 2,2µF +/-20% 10V 0402)
C24  value 100pF  [CAPC1005X56X25LL10T15]  (hidden comment: 04023A101JAT2A)
R10  value 49.9  [RESC1005X40X25LL10T10]  (hidden comment: MC00625W0402149R9)
U4  HMC582LP5ETR  [HCP-32-1]

### Ports
VCO_RFOUT (out), VCO_RFOUT/2 (out), VCO_VTUNE (in)

### Nets
5V: C19.1 C20.2 C21.1 C22.2 C23.2 C24.1 U4.6(VCC1) U4.7(VCC2) U4.21(VCC3)
GND: C19.2 C20.1 C21.2 C22.1 C23.1 C24.2 R10.1 U4.5(GND) U4.11(GND) U4.33(PAD)
NetC16_1: U4.29(VTUNE) ; port VCO_VTUNE
NetC18_1: C18.1 U4.4(RFOUT/4)
NetC18_2: C18.2 R10.2
NetR1_1: U4.19(RFOUT) ; port VCO_RFOUT
NetR12_1: U4.12(RFOUT/2) ; port VCO_RFOUT/2

Not connected (* = marked no-connect by the designer): U4 1(NC)* 2(NC)* 3(NC)* 8(NC)* 9(NC)* 10(NC)* 13(NC)* 14(NC)* 15(NC)* 16(NC)* 17(NC)* 18(NC)* 20(NC)* 22(NC)* 23(NC)* 24(NC)* 25(NC)* 26(NC)* 27(NC)* 28(NC)* 30(NC)* 31(NC)* 32(NC)*

### Notes on the sheet
- /

### Library data of the parts
C18 = CMP-001-00066-4: Chip Capacitor, 1nF +/-20%, 50V, 0402, Thickness 0.33 mm; Tolerance: 10%; Case/Package: 0402; Max Operating Temperature: 85°C; Min Operating Temperature: -55°C; Mounting Technology: SMT; Voltage Rating: 50V; Pins: 2
C19 C21 C23 = CMP-001-00056-5: Chip Capacitor, 2,2µF +/-20%, 10V, 0402, Thickness 0.6 mm; Tolerance: 10%; Case/Package: 0402; Max Operating Temperature: 85°C; Mounting Technology: SMT; Voltage Rating: 10V; Min Operating Temperature: -55°C; Pins: 2
C20 C22 C24 = CMP-001-00083-2: as C38 on sheet DACWaveyRadar
R10 = CMP-009-00186-1: RESISTOR, 49R9, 0.063W, 1%, 0402
U4 = CMP-00025-00008-5: Voltage Controlled Oscillator 11100MHz to 12400MHz 32-Pin QFN T/R

## Sheet PowerWaveyRadar.SchDoc: Power WaveyRadar Schematic
size Letter; Author: Will Vu; CompanyName: Raccoon Wireless; DrawnBy: Will Vu, Raccoon Wireless; Engineer: Will Vu; Organization: Raccoon Wireless; DocumentNumber: 2-13; Revision: 2; SheetNumber: 13; SheetTotal: 15
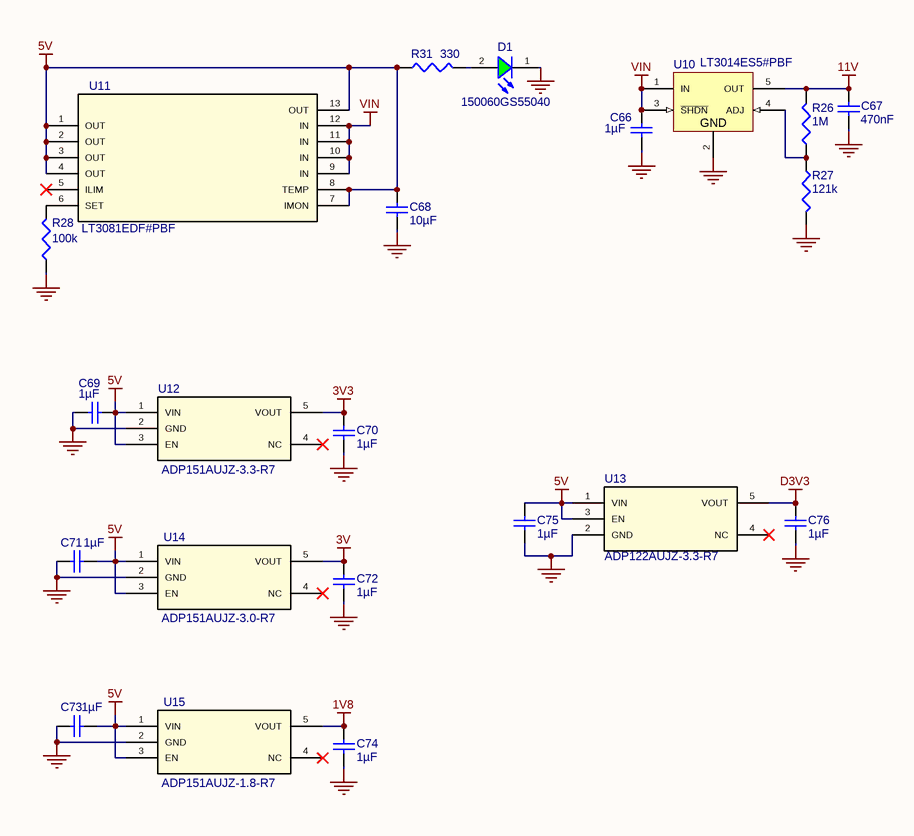
[diagram p9: PowerWaveyRadar.SchDoc]

### Parts
C66  value 1µF  [CAPC0402(1005)60_L]  (hidden comment: Capacitor 1µF +/-20% 10V 0402)
C67  value 470nF  [CAPC0402(1005)60_L]  (hidden comment: Capacitor 470nF +/-40% 10V 0402)
C68  value 10µF  [CAPC0402(1005)60_L]  (hidden comment: Capacitor 10µF +/-40% 6.3V 0402)
C69  value 1µF  [CAPC0402(1005)60_L]  (hidden comment: Capacitor 1µF +/-20% 10V 0402)
C70  value 1µF  [CAPC0402(1005)60_L]  (hidden comment: Capacitor 1µF +/-20% 10V 0402)
C71  value 1µF  [CAPC0402(1005)60_L]  (hidden comment: Capacitor 1µF +/-20% 10V 0402)
C72  value 1µF  [CAPC0402(1005)60_L]  (hidden comment: Capacitor 1µF +/-20% 10V 0402)
C73  value 1µF  [CAPC0402(1005)60_L]  (hidden comment: Capacitor 1µF +/-20% 10V 0402)
C74  value 1µF  [CAPC0402(1005)60_L]  (hidden comment: Capacitor 1µF +/-20% 10V 0402)
C75  value 1µF  [CAPC0402(1005)60_L]  (hidden comment: Capacitor 1µF +/-20% 10V 0402)
C76  value 1µF  [CAPC0402(1005)60_L]  (hidden comment: Capacitor 1µF +/-20% 10V 0402)
D1  150060GS55040  [WL-SMCD_0603]
R26  value 1M  [RESC0402(1005)_L]  (hidden comment: Resistor 1M +/-1 % 0402 63 mW)
R27  value 121k  [RESC0402(1005)_L]  (hidden comment: Resistor 121K +/-1 % 0402 63 mW)
R28  value 100k  [RESC1005X40X25ML05T05]  (hidden comment: Resistor 100k +/-1% 0402 100 mW)
R31  value 330  [RESC0402(1005)_L]  (hidden comment: Resistor 330R +/-5 % 0402 63 mW)
U10  LT3014ES5#PBF  [LT-S5-5-TSOT-23_M]
U11  LT3081EDF#PBF  [DFN-12_DF]
U12  ADP151AUJZ-3.3-R7  [UJ_5]
U13  ADP122AUJZ-3.3-R7  [UJ_5_ADI]
U14  ADP151AUJZ-3.0-R7  [UJ_5]
U15  ADP151AUJZ-1.8-R7  [UJ_5]

### Nets
1V8: C74.1 U15.5(VOUT)
3V: C72.2 U14.5(VOUT)
3V3: C70.1 U12.5(VOUT)
5V: C68.2 C69.1 C71.2 C73.2 C75.2 R31.1 U11.1(OUT) U11.2(OUT) U11.3(OUT) U11.4(OUT) U11.7(IMON) U11.8(TEMP) U11.13(OUT) U12.1(VIN) U12.3(EN) U13.1(VIN) U13.3(EN) U14.1(VIN) U14.3(EN) U15.1(VIN) U15.3(EN)
11V: C67.2 R26.2 U10.5(OUT)
D3V3: C76.2 U13.5(VOUT)
GND: C66.1 C67.1 C68.1 C69.2 C70.2 C71.1 C72.1 C73.1 C74.2 C75.1 C76.1 D1.1(K) R27.2 R28.1 U10.2(GND) U12.2(GND) U13.2(GND) U14.2(GND) U15.2(GND)
VIN: C66.2 U10.1(IN) U10.3(~{SHDN}) U11.9(IN) U11.10(IN) U11.11(IN) U11.12(IN)
NetD1_2: D1.2(A) R31.2
NetR26_1: R26.1 R27.1 U10.4(ADJ)
NetR28_2: R28.2 U11.6(SET)

Not connected (* = marked no-connect by the designer): U11 5(ILIM)*; U12 4(NC)*; U13 4(NC)*; U14 4(NC)*; U15 4(NC)*

### Notes on the sheet
- /

### Library data of the parts
C66 C69-C76 = CMP-001-00063-4: as C77 on sheet ControllerWaveyRadar; Max Operating Temperature: 85°C; Mounting Technology: SMT; Pins: 2; Min Operating Temperature: -55°C; Voltage Rating: 10V; Case/Package: 0402
C67 = CMP-001-00060-5: Chip Capacitor, 470nF +/-40%, 10V, 0402, Thickness 0.6 mm; Tolerance: 20%; Pins: 2; Voltage Rating: 10V; Mounting Technology: SMT; Min Operating Temperature: -55°C; Case/Package: 0402; Max Operating Temperature: 85°C
C68 = CMP-001-00074-4: Chip Capacitor, 10µF +/-40%, 6.3V, 0402, Thickness 0.6 mm; Tolerance: 10%; Mounting Technology: SMT; Case/Package: 0402; Pins: 2; Max Operating Temperature: 85°C; Voltage Rating: 6.3V; Min Operating Temperature: -55°C
D1 = CMP-072-000001-1: WL-SMCD SMT Mono-color Chip LED Diffused, size 0603, Green, 3.2V, 140deg; Chip Technology: InGaN; Dominant Wavelength: 525nm; Peak Wavelength: 520nm; Luminous Intensity: 430mcd; Packaging: Tape and Reel; ComponentLink2URL: https://katalog.we-online.de/led/datasheet/150060GS55040.pdf; Design Item ID: 150060GS55040; ComponentLink1URL: http://www.we-online.de; Size: 0603; Published Date: October 2019; Forward Voltage: 3.2V; Viewing Angle: 140deg; ComponentLink1Description: Manufacturer; Operating Temperature: -40 to +85degC; ComponentLink2Description: Datasheet; Mounting Technology: SMT; Emitting Color: Green; Publisher: Wurth Elektronik; Part Number: 150060GS55040; Source: WL-SMCD.SchLib
R26 = CMP-009-00165-4: Chip Resistor, 1 MOhms, +/-1 %, 63 mW, -55 to 155 degC, 0402; Power: 63mW; Tolerance: 1%; Case/Package: 0402; Pins: 2
R27 = CMP-009-00133-4: Chip Resistor, 121 kOhms, +/-1 %, 63 mW, -55 to 155 degC, 0402; Power: 63mW; Tolerance: 1%; Min Operating Temperature: -55°C; Max Operating Temperature: 155°C; Pins: 2; Case/Package: 0402
R28 = CMP-009-00022-6: Chip Resistor, 100 KOhm, +/- 1%, 0.1 W, -55 to 155 degC, 0402 (1005 Metric); Power: 100mW; Voltage Rating: 50V; Mounting Technology: SM; Min Operating Temperature: -55°C; Max Operating Temperature: 155°C; Tolerance: 1%; RoHS Compliant: True; Case/Package: 0402; Pins: 2
R31 = CMP-009-00132-4: Chip Resistor, 330 Ohms, +/-5 %, 63 mW, -55 to 155 degC, 0402; Power: 63mW; Tolerance: 5%; Pins: 2; Max Operating Temperature: 155°C; Min Operating Temperature: -55°C; Case/Package: 0402
U10 = CMP-019-00051-3: LINEAR TECHNOLOGY   LT3014ES5#PBF   LDO Voltage Regulator, Adjustable, 3V to 80V in, 350mV drop, 1.22V to 60V/20mA out, SOT-23-5
U11 = CMP-029-000000-4: No Description Available; Vendor: Linear Technology; Design Item ID: LT3081EDF#PBF; Manufacturer_Part_Number: lt3081edf#pbf; Copyright: Copyright (C) 2018 Accelerated Designs. All rights reserved; RefDes: RefDes; Type: DEV; Source: 2021-06-02_19-29-38.SchLib
U12 = CMP-019-00050-3: Ultralow Noise, 200 mA, CMOS Linear Regulator; VOUT: 3.3v
U13 = CMP-067-000000-1: 5.5 V Input, 300 mA, Low Quiescent Current, CMOS Linear Regulator, Fixed Output Voltage; Built_By: Analog Devices Inc.; Vendor: Analog Devices Inc; SourceLibrary: Analog_2018-03-03; Source: 2021-07-06_01-52-51.SchLib; RefDes: RefDes; Type: DEV; Manufacturer_Part_Number: ADP122AUJZ-3.3-R7; Copyright: Copyright (C) 2021 Accelerated Designs. All rights reserved; Design Item ID: ADP122AUJZ-3.3-R7
U14 = CMP-019-00049-3: Ultralow Noise, 200 mA, CMOS Linear Regulator; VOUT: 3v
U15 = CMP-032-000000-4: Ultralow Noise, 200 mA, CMOS Linear Regulator; VOUT: 1.8v; Source: 2021-06-02_20-26-29.SchLib; Design Item ID: ADP151AUJZ-1.8-R7

## Sheet SplitterWaveyRadar.SchDoc: Splitter WaveyRadar Schematic
size Letter; Author: Will Vu; CompanyName: Raccoon Wireless; DrawnBy: Will Vu, Raccoon Wireless; Engineer: Will Vu; Organization: Raccoon Wireless; DocumentNumber: 2-06; Revision: 2; SheetNumber: 6; SheetTotal: 15
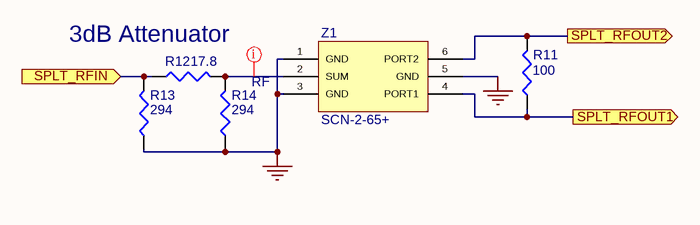
[diagram p10: SplitterWaveyRadar.SchDoc]

### Parts
R11  value 100  [RESC0402(1005)_L]  (hidden comment: Resistor 100R +/-1 % 0402 63 mW)
R12  value 17.8  [FP-CR0402-IPC_C]  (hidden comment: CR0402-FX-17R8GLF)
R13  value 294  [RESC1005X40X25NL05T10]  (hidden comment: RC0402FR-07294RL)
R14  value 294  [RESC1005X40X25NL05T10]  (hidden comment: RC0402FR-07294RL)
Z1  SCN-2-65+  [SCN-2-65+-Footprint-1]

### Ports
SPLT_RFIN (in), SPLT_RFOUT1 (out), SPLT_RFOUT2 (out)

### Nets
GND: R13.1 R14.1 Z1.1(GND) Z1.3(GND) Z1.5(GND)
NetC28_1: R11.2 Z1.6(PORT2) ; port SPLT_RFOUT2
NetIC1_9: R11.1 Z1.4(PORT1) ; port SPLT_RFOUT1
NetR12_1: R12.1 R13.2 ; port SPLT_RFIN
NetR12_2: R12.2 R14.2 Z1.2(SUM)

### Layout directives
net class RF: NetR12_2

### Notes on the sheet
- 3dB Attenuator
- /

### Library data of the parts
R11 = CMP-009-00167-4: as R23 on sheet DACWaveyRadar; Pins: 2; Min Operating Temperature: -55°C; Case/Package: 0402; Max Operating Temperature: 155°C
R12 = CMP-009-00191-1: Thick Film Resistors - SMD 17.8OHM 1/16WATT 1%
R13 R14 = CMP-009-00190-1: Res Thick Film 0402 294 Ohm 1% 1/16W 100ppm/C Molded SMD Paper T/R
Z1 = CMP-00025-00003-5: 2-Way 50 ohm Power Splitter/Combiner. 5500 to 6500MHz; Frequency: 6GHz; Case/Package: FV1206-1

## Sheet SwitchBypassWaveyRadar.SchDoc: Switch Bypass WaveyRadar Schematic
size Letter; Author: Will Vu; CompanyName: Raccoon Wireless; DrawnBy: Will Vu, Raccoon Wireless; Engineer: Will Vu; Organization: Raccoon Wireless; DocumentNumber: 2-07; Revision: 2; SheetNumber: 7; SheetTotal: 15
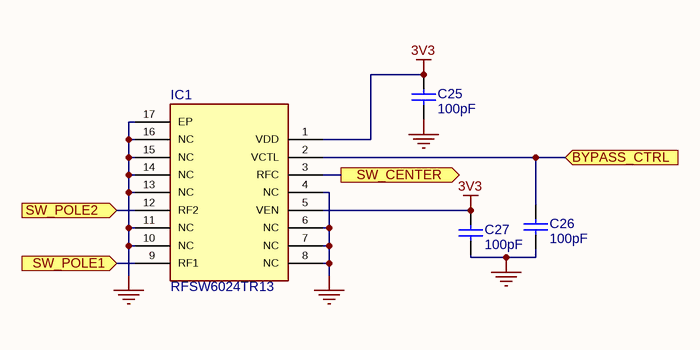
[diagram p11: SwitchBypassWaveyRadar.SchDoc]

### Parts
C25  value 100pF  [CAPC1005X56X25LL10T15]  (hidden comment: 04023A101JAT2A)
C26  value 100pF  [CAPC1005X56X25LL10T15]  (hidden comment: 04023A101JAT2A)
C27  value 100pF  [CAPC1005X56X25LL10T15]  (hidden comment: 04023A101JAT2A)
IC1  RFSW6024TR13  [QFN65P400X400X90-17N]

### Ports
BYPASS_CTRL (in), SW_CENTER (out), SW_POLE1 (in), SW_POLE2 (in)

### Nets
3V3: C25.2 C27.1 IC1.1(VDD) IC1.5(VEN)
GND: C25.1 C26.2 C27.2 IC1.4(NC) IC1.6(NC) IC1.7(NC) IC1.8(NC) IC1.10(NC) IC1.11(NC) IC1.13(NC) IC1.14(NC) IC1.15(NC) IC1.16(NC) IC1.17(EP)
NetC26_1: C26.1 IC1.2(VCTL) ; port BYPASS_CTRL
NetDC1_6: IC1.12(RF2) ; port SW_POLE2
NetIC1_3: IC1.3(RFC) ; port SW_CENTER
NetIC1_9: IC1.9(RF1) ; port SW_POLE1

### Notes on the sheet
- /

### Library data of the parts
C25-C27 = CMP-001-00083-2: as C38 on sheet DACWaveyRadar
IC1 = CMP-023-000002-3: Integrated Circuit; Manufacturer_Name: Qorvo; Height: 0.9mm; Source: SamacSys.SchLib; Mouser2 Price/Stock: https://www.mouser.com/Search/Refine.aspx?Keyword=772-RFSW6024TR13; Datasheet Link: https://componentsearchengine.com//RFSW6024TR13.pdf; Design Item ID: RFSW6024TR13; Mouser2 Part Number: 772-RFSW6024TR13; Manufacturer_Part_Number: RFSW6024TR13

## Sheet TxFrontendWaveyRadar.SchDoc: Tx Frontend WaveyRadar Schematic
size Letter; Author: Will Vu; CompanyName: Raccoon Wireless; DrawnBy: Will Vu, Raccoon Wireless; Engineer: Will Vu; Organization: Raccoon Wireless; DocumentNumber: 2-11; Revision: 2; SheetNumber: 11; SheetTotal: 15
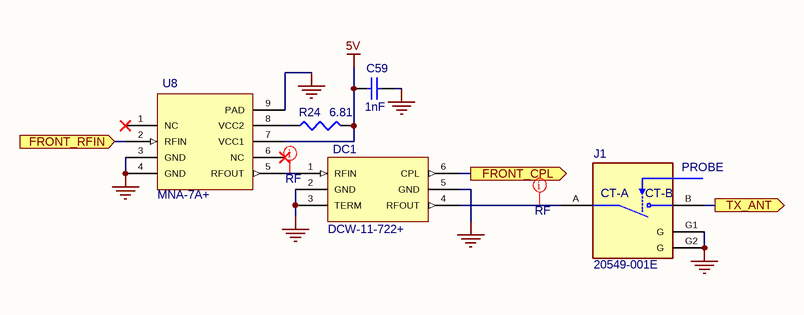
[diagram p12: TxFrontendWaveyRadar.SchDoc]

### Parts
C59  value 1nF  [CAPC0402(1005)33_L]  (hidden comment: Capacitor 1nF +/-20% 50V 0402)
DC1  DCW-11-722+  [DCW-11-722+-Footprint-1]
J1  20549-001E  [IPEX_20549-001E]
R24  value 6.81  [RESC1005X40X25NL05T05]  (hidden comment: CRCW04026R81FKED)
U8  MNA-7A+  [DQ849]

### Ports
FRONT_CPL (out), FRONT_RFIN (in), TX_ANT (out)

### Nets
5V: C59.2 R24.2 U8.7(VCC1)
GND: C59.1 DC1.2(GND) DC1.3(TERM) DC1.5(GND) J1.G1(G) J1.G2(G) U8.3(GND) U8.4(GND) U8.9(PAD)
NetA1_1: J1.B(CT-B) ; port TX_ANT
NetC31_2: U8.2(RFIN) ; port FRONT_RFIN
NetDC1_1: DC1.1(RFIN) U8.5(RFOUT)
NetDC1_4: DC1.4(RFOUT) J1.A(CT-A)
NetDC1_6: DC1.6(CPL) ; port FRONT_CPL
NetR24_1: R24.1 U8.8(VCC2)

Not connected (* = marked no-connect by the designer): U8 1(NC)* 6(NC)*

### Layout directives
net class RF: NetDC1_1, NetDC1_4

### Notes on the sheet
- /
- (in symbol CMP-044-000000-6) PROBE

### Library data of the parts
C59 = CMP-001-00066-4: as C18 on sheet VCOWaveyRadar; Case/Package: 0402; Max Operating Temperature: 85°C; Min Operating Temperature: -55°C; Mounting Technology: SMT; Voltage Rating: 50V; Pins: 2
DC1 = CMP-00025-00006-2: 50 ohm 11dB directional coupler 2.4 to 7.2 GHz; Impedance: 50 ohm; Coupling: 11dB
J1 = CMP-044-000000-6: 1 POS Vertical SMD Coaxial RF switch connector with a 2.3 x 2.3 mm footprint and support to 11 GHz, MHC; MF: I-PEX; Source: 20549-001E.SchLib; SnapEDA_Link: https://www.snapeda.com/parts/20549-001E/I-PEX/view-part/3220455/?ref=snap; Value: *; Design Item ID: 20549-001E; Package: None; Check_prices: https://www.snapeda.com/parts/20549-001E/I-PEX/view-part/3220455/?ref=eda; Price: None; Availability: Warning; MP: 20549-001E
R24 = CMP-009-00193-1: CRCW Series 0402 0.063 W 6.81 Ohm ±1 % ±100 ppm/K SMT Thick Film Chip Resistor
U8 = CMP-00025-00005-2: 50 ohm 1.5 to 6GHz 17.4db amplifier; Impedance: 50; Case Style: DQ849

## Sheet RxFrontendWaveyRadar.SchDoc: Rx Frontend WaveyRadar Schematic
size Letter; Author: Will Vu; CompanyName: Raccoon Wireless; DrawnBy: Will Vu, Raccoon Wireless; Engineer: Will Vu; Organization: Raccoon Wireless; DocumentNumber: 2-12; Revision: 2; SheetNumber: 12; SheetTotal: 15
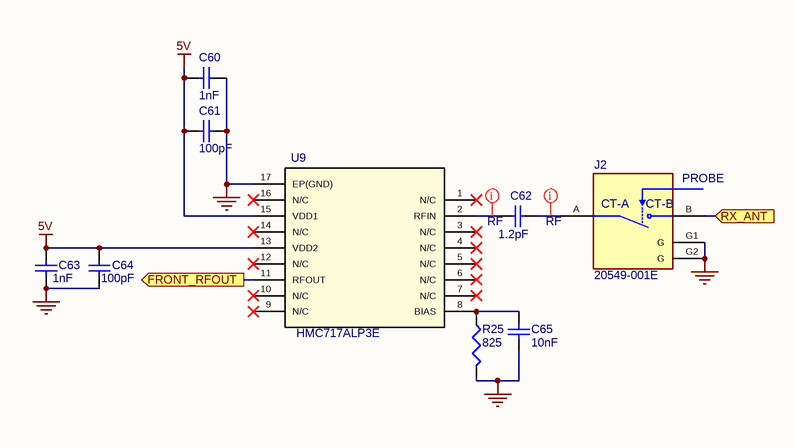
[diagram p13: RxFrontendWaveyRadar.SchDoc]

### Parts
C60  value 1nF  [CAPC0402(1005)33_L]  (hidden comment: Capacitor 1nF +/-20% 50V 0402)
C61  value 100pF  [CAPC1005X56X25LL10T15]  (hidden comment: 04023A101JAT2A)
C62  value 1.2pF  [FP-C0402-BB-MFG]  (hidden comment: C0402C129C5GACTU)
C63  value 1nF  [CAPC0402(1005)33_L]  (hidden comment: Capacitor 1nF +/-20% 50V 0402)
C64  value 100pF  [CAPC1005X56X25LL10T15]  (hidden comment: 04023A101JAT2A)
C65  value 10nF  [CAPC0402(1005)60_L]  (hidden comment: Capacitor 10nF +/-20% 50V 0402)
J2  20549-001E  [IPEX_20549-001E]
R25  value 825  [RESC1005X40X25NL05T05]  (hidden comment: CRCW0402825RFKED)
U9  HMC717ALP3E  [HCP_16_3]

### Ports
FRONT_RFOUT (out), RX_ANT (in)

### Nets
5V: C60.2 C61.2 C63.2 C64.2 U9.13(VDD2) U9.15(VDD1)
GND: C60.1 C61.1 C63.1 C64.1 C65.2 J2.G1(G) J2.G2(G) R25.2 U9.17(EP(GND))
NetA2_1: J2.B(CT-B) ; port RX_ANT
NetC62_1: C62.1 U9.2(RFIN)
NetC62_2: C62.2 J2.A(CT-A)
NetC65_1: C65.1 R25.1 U9.8(BIAS)
NetU7_5: U9.11(RFOUT) ; port FRONT_RFOUT

Not connected (* = marked no-connect by the designer): U9 1(N/C)* 3(N/C)* 4(N/C)* 5(N/C)* 6(N/C)* 7(N/C)* 9(N/C)* 10(N/C)* 12(N/C)* 14(N/C)* 16(N/C)*

### Layout directives
net class RF: NetC62_1, NetC62_2

### Notes on the sheet
- /
- (in symbol CMP-044-000000-6) PROBE

### Library data of the parts
C60 C63 = CMP-001-00066-4: as C18 on sheet VCOWaveyRadar; Case/Package: 0402; Max Operating Temperature: 85°C; Min Operating Temperature: -55°C; Mounting Technology: SMT; Voltage Rating: 50V; Pins: 2
C61 C64 = CMP-001-00083-2: as C38 on sheet DACWaveyRadar
C62 = CMP-001-00085-1: Cap Ceramic 1.2pF 50V C0G 0.25pF SMD 0402 125°C Paper T/R
C65 = CMP-001-00069-4: as C35 on sheet DACWaveyRadar; Max Operating Temperature: 85°C; Voltage Rating: 50V; Case/Package: 0402; Pins: 2; Min Operating Temperature: -55°C; Mounting Technology: SMT
J2 = CMP-044-000000-6: as J1 on sheet TxFrontendWaveyRadar; Source: 20549-001E.SchLib; SnapEDA_Link: https://www.snapeda.com/parts/20549-001E/I-PEX/view-part/3220455/?ref=snap; Value: *; Design Item ID: 20549-001E; Package: None; Check_prices: https://www.snapeda.com/parts/20549-001E/I-PEX/view-part/3220455/?ref=eda; Price: None; Availability: Warning; MP: 20549-001E
R25 = CMP-009-00194-1: Resistor;  Thick Film;  825 Ohms;  0.063 W;  1%;  SMT;  0402;  TCR 37 ppm/DegC;  Cut Tape
U9 = CMP-026-000000-4: No Description Available; RefDes: RefDes; Type: DEV; Source: 2021-06-01_15-55-40.SchLib; Copyright: Copyright (C) 2018 Accelerated Designs. All rights reserved; Design Item ID: HMC717ALP3E

## Sheet InterfacesWaveyRadar.SchDoc: Interfaces WaveyRadar Schematic
size Letter; Author: Will Vu; CompanyName: Raccoon Wireless; DrawnBy: Will Vu, Raccoon Wireless; Engineer: Will Vu; Organization: Raccoon Wireless; DocumentNumber: 2-14; Revision: 2; SheetNumber: 14; SheetTotal: 15
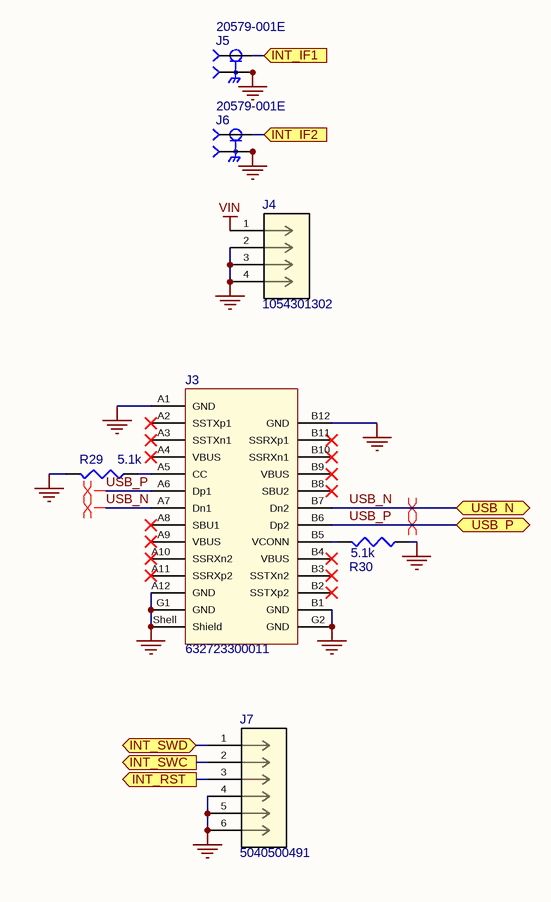
[diagram p14: InterfacesWaveyRadar.SchDoc]

### Parts
J3  632723300011  [632723300011]
J4  1054301302  [CON_1054301302_MOL]
J5  20579-001E  [IPEX_20579-001E]
J6  20579-001E  [IPEX_20579-001E]
J7  5040500491  [CON_5040500491]
R29  value 5.1k  [RESC1005X40X25NL05T05]  (hidden comment: ERJ-2RKF5101X)
R30  value 5.1k  [RESC1005X40X25NL05T05]  (hidden comment: ERJ-2RKF5101X)

### Ports
INT_IF1 (in), INT_IF2 (in), INT_RST (out), INT_SWC (out), INT_SWD (bidir), USB_N (bidir), USB_P (bidir)

### Nets
GND: J3.A1(GND) J3.A12(GND) J3.B1(GND) J3.B12(GND) J3.G1(GND) J3.G2(GND) J3.Shell(Shield) J4.2 J4.3 J4.4 J5.G1(GROUND) J5.G2(GROUND) J5.G3(GROUND) J6.G1(GROUND) J6.G2(GROUND) J6.G3(GROUND) J7.4 J7.5 J7.6 R29.2 R30.1
VIN: J4.1
USB_N: J3.A7(Dn1) J3.B7(Dn2) ; port USB_N  [project net D_N]
USB_P: J3.A6(Dp1) J3.B6(Dp2) ; port USB_P  [project net D_P]
NetJ3_A5: J3.A5(CC) R29.1
NetJ3_B5: J3.B5(VCONN) R30.2
NetJ5_1: J5.1(SIGNAL) ; port INT_IF1
NetJ6_1: J6.1(SIGNAL) ; port INT_IF2
NetJ7_1: J7.1 ; port INT_SWD
NetJ7_2: J7.2 ; port INT_SWC
NetJ7_3: J7.3 ; port INT_RST

Not connected (* = marked no-connect by the designer): J3 A2(SSTXp1)* A3(SSTXn1)* A4(VBUS)* A8(SBU1)* A9(VBUS)* A10(SSRXn2)* A11(SSRXp2)* B2(SSTXp2)* B3(SSTXn2)* B4(VBUS)* B8(SBU2)* B9(VBUS)* B10(SSRXn1)* B11(SSRXp1)*

### Layout directives
differential pair: D_N, D_P

### Notes on the sheet
- /

### Library data of the parts
J3 = CMP-069-000006-3: USB 3.1 Type C, Receptacle, Horizontal, THR; Manufacturer: Wurth Elektronik; Pin Number: 24; Working Voltage: 20VAC; Interface Type: Type C; Rated Current: 5A; Gender: Receptacle; Mounting Technology: THR; Packaging: Tape and Reel; Type: Horizontal; Operating Temperature: -40 to +105degC; ComponentLink1Description: Manufacturer; ComponentLink1URL: http://www.we-online.de; Published Date: August 2020; ComponentLink2URL: https://katalog.we-online.com/em/datasheet/632723300011.pdf; ComponentLink2Description: Datasheet; Manufacturer Part Number: 632723300011; Application: USB 3.1; Source: WR-USB_USB 3.1.SchLib; Design Item ID: 632723300011
J4 = CMP-035-000000-2: Nano-Fit Right-Angle Header, Surface Mount, 2.50mm Pitch, Single Row, 2 Circuits, 0.76µm Gold (Au) Plating, Black, Glow-Wire Capable; Vendor: Molex Connector Corporation; Built_By: Molex_Team; SourceLibrary: Add_to_database_2021-02-05; Source: 2021-06-03_11-41-49.SchLib; RefDes: RefDes; Copyright: Copyright (C) 2018 Accelerated Designs. All rights reserved; Design Item ID: 1054301302; Type: DEV; Manufacturer_Part_Number: 1054301302
J5 J6 = CMP-041-000000-4: 12GHz RF recepticle with lock; MF: I-PEX; Price: None; Value: *; MP: 20579-001E; Design Item ID: 20579-001E; Availability: Unavailable; Package: None; SnapEDA_Link: https://www.snapeda.com/parts/20579-001E/I-PEX/view-part/4300957/?ref=snap; Source: SnapEDAsch.SchLib
J7 = CMP-086-000000-2: 1.50mm Pitch, Pico-Lock PCB Header, Single Row, Right-Angle, Surface Mount, Gold (Au) Plating, Positive Lock, 4 Circuits, Tape and Reel; Built_By: Molex_Team; SourceLibrary: Add_to_database_2021-03-17; Vendor: Molex Connector Corporation; Copyright: Copyright (C) 2018 Accelerated Designs. All rights reserved; Design Item ID: 5040500491; Source: 2021-07-07_15-40-05.SchLib; Manufacturer_Part_Number: 5040500491; Type: DEV; RefDes: RefDes
R29 R30 = CMP-009-00180-5: as R4 on sheet RampPLLWaveyRadar